# EAGLE design main (EAGLE 5.04)

## Sheet 1 of 2
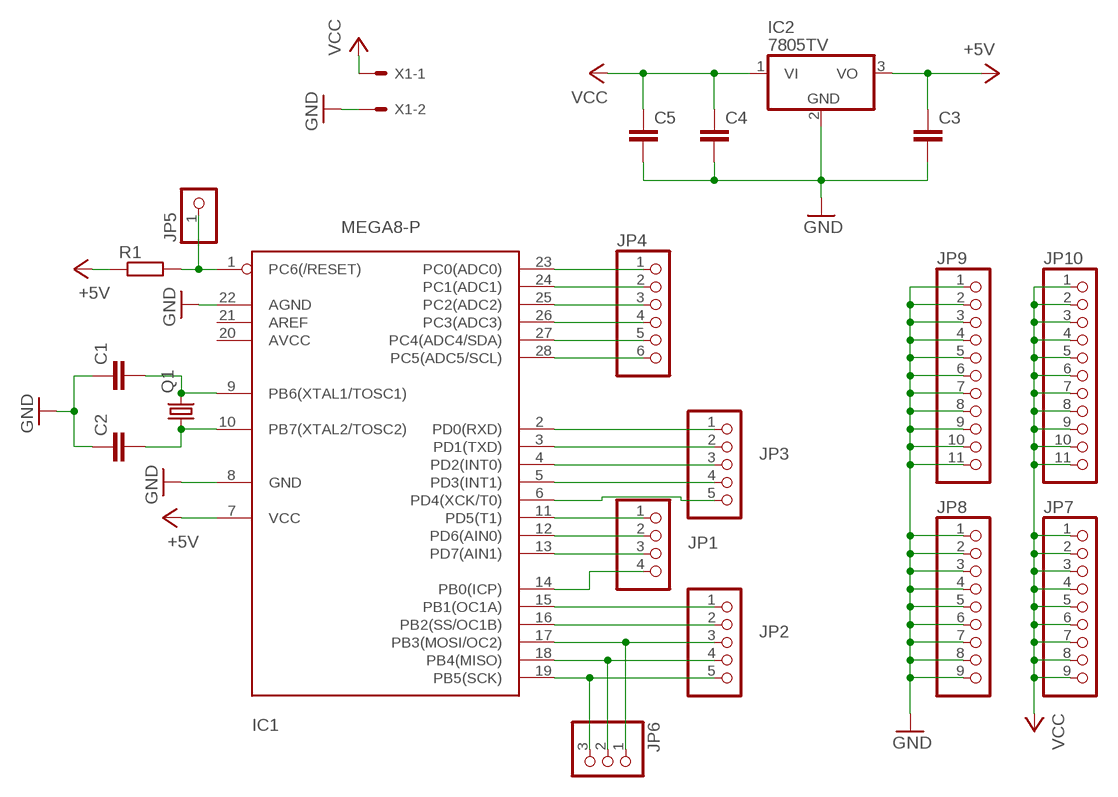
[diagram p0: schematic, sheet 1]

### Parts
C1  C-EUC0805  [C0805]
C2  C-EUC0805  [C0805]
C3  C-EUC1206  [C1206]
C4  C-EUC1206  [C1206]
C5  C-EUC1206  [C1206]
IC1  MEGA8-P  [DIL28-3]
IC2  7805TV  [TO220V]
JP1  PINHD-1X4  [1X04]
JP2  PINHD-1X5  [1X05]
JP3  PINHD-1X5  [1X05]
JP4  PINHD-1X6  [1X06]
JP5  PINHD-1X1  [1X01]
JP6  PINHD-1X3  [1X03]
JP7  PINHD-1X9  [1X09]
JP8  PINHD-1X9  [1X09]
JP9  PINHD-1X11  [1X11]
JP10  PINHD-1X11  [1X11]
Q1  CRYSTALHC49U70  [HC49U70]
R1  R-EU_R0805  [R0805]
X1  KK-156-2  [KK-156-2]

### Nets
+5V: C3.1 IC1.7(VCC) IC2.3(VO) R1.1
GND: C1.1 C2.1 C3.2 C4.2 C5.2 IC1.8(GND) IC1.22(AGND) IC2.2(GND) JP8.1 JP8.2 JP8.3 JP8.4 JP8.5 JP8.6 JP8.7 JP8.8 JP8.9 JP9.1 JP9.2 JP9.3 JP9.4 JP9.5 JP9.6 JP9.7 JP9.8 JP9.9 JP9.10 JP9.11 X1.2
N$1: IC1.13(PD7(AIN1)) JP1.3
N$2: IC1.12(PD6(AIN0)) JP1.2
N$3: IC1.11(PD5(T1)) JP1.1
N$4: IC1.14(PB0(ICP)) JP1.4
N$5: IC1.23(PC0(ADC0)) JP4.1
N$6: IC1.24(PC1(ADC1)) JP4.2
N$7: IC1.25(PC2(ADC2)) JP4.3
N$8: IC1.26(PC3(ADC3)) JP4.4
N$9: IC1.27(PC4(ADC4/SDA)) JP4.5
N$10: IC1.28(PC5(ADC5/SCL)) JP4.6
N$11: IC1.2(PD0(RXD)) JP3.1
N$12: IC1.3(PD1(TXD)) JP3.2
N$13: IC1.4(PD2(INT0)) JP3.3
N$14: IC1.5(PD3(INT1)) JP3.4
N$15: IC1.6(PD4(XCK/T0)) JP3.5
N$16: IC1.15(PB1(OC1A)) JP2.1
N$17: IC1.16(PB2(SS/OC1B)) JP2.2
N$18: IC1.17(PB3(MOSI/OC2)) JP2.3 JP6.1
N$19: IC1.18(PB4(MISO)) JP2.4 JP6.2
N$20: IC1.19(PB5(SCK)) JP2.5 JP6.3
N$21: C2.2 IC1.10(PB7(XTAL2/TOSC2)) Q1.1
N$22: C1.2 IC1.9(PB6(XTAL1/TOSC1)) Q1.2
N$25: IC1.1(PC6(/RESET)) JP5.1 R1.2
VCC: C4.1 C5.1 IC2.1(VI) JP7.1 JP7.2 JP7.3 JP7.4 JP7.5 JP7.6 JP7.7 JP7.8 JP7.9 JP10.1 JP10.2 JP10.3 JP10.4 JP10.5 JP10.6 JP10.7 JP10.8 JP10.9 JP10.10 JP10.11 X1.1
Unconnected: IC1.21(AREF)

## Sheet 2 of 2
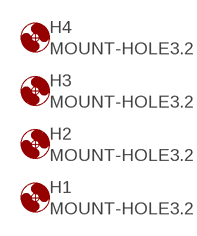
[diagram p1: schematic, sheet 2]

### Parts
H1  MOUNT-HOLE3.2  [3,2]
H2  MOUNT-HOLE3.2  [3,2]
H3  MOUNT-HOLE3.2  [3,2]
H4  MOUNT-HOLE3.2  [3,2]

## Power pins joined to a net without a drawn wire
AVCC: IC1.20(AVCC)

## Library data of the parts
C1-C5 = rcl:C-EU: CAPACITOR, European symbol
H1-H4 = holes:MOUNT-HOLE: MOUNTING HOLE with drill center marker
IC1 = atmel:MEGA8-P: MICROCONTROLLER 8 Kbytes FLASH, 1 kbytes SRAM, 512 bytes EEPROM, USART, 4-channel 10 bit ADC, 2-channel 8 bit ADC Pin compatible with Atmega48, ATMega88, ATMega168 Source: avr.lbr
IC2 = linear:78*: Positive VOLTAGE REGULATOR Source: http://cache.national.com/ds/LM/LM78L05.pdf http://www.fairchildsemi.com/ds/LM/LM7805.pdf
JP1 = pinhead:PINHD-1X4: PIN HEADER
JP2 JP3 = pinhead:PINHD-1X5: PIN HEADER
JP4 = pinhead:PINHD-1X6: PIN HEADER
JP5 = pinhead:PINHD-1X1: PIN HEADER
JP6 = pinhead:PINHD-1X3: PIN HEADER
JP7 JP8 = pinhead:PINHD-1X9: PIN HEADER
JP9 JP10 = pinhead:PINHD-1X11: PIN HEADER
Q1 = crystal:CRYSTAL: CRYSTAL
R1 = rcl:R-EU_: RESISTOR, European symbol
X1 = con-molex:KK-156-2: KK 156 HEADER Source: http://www.molex.com/pdm_docs/sd/026604100_sd.pdf

## Board
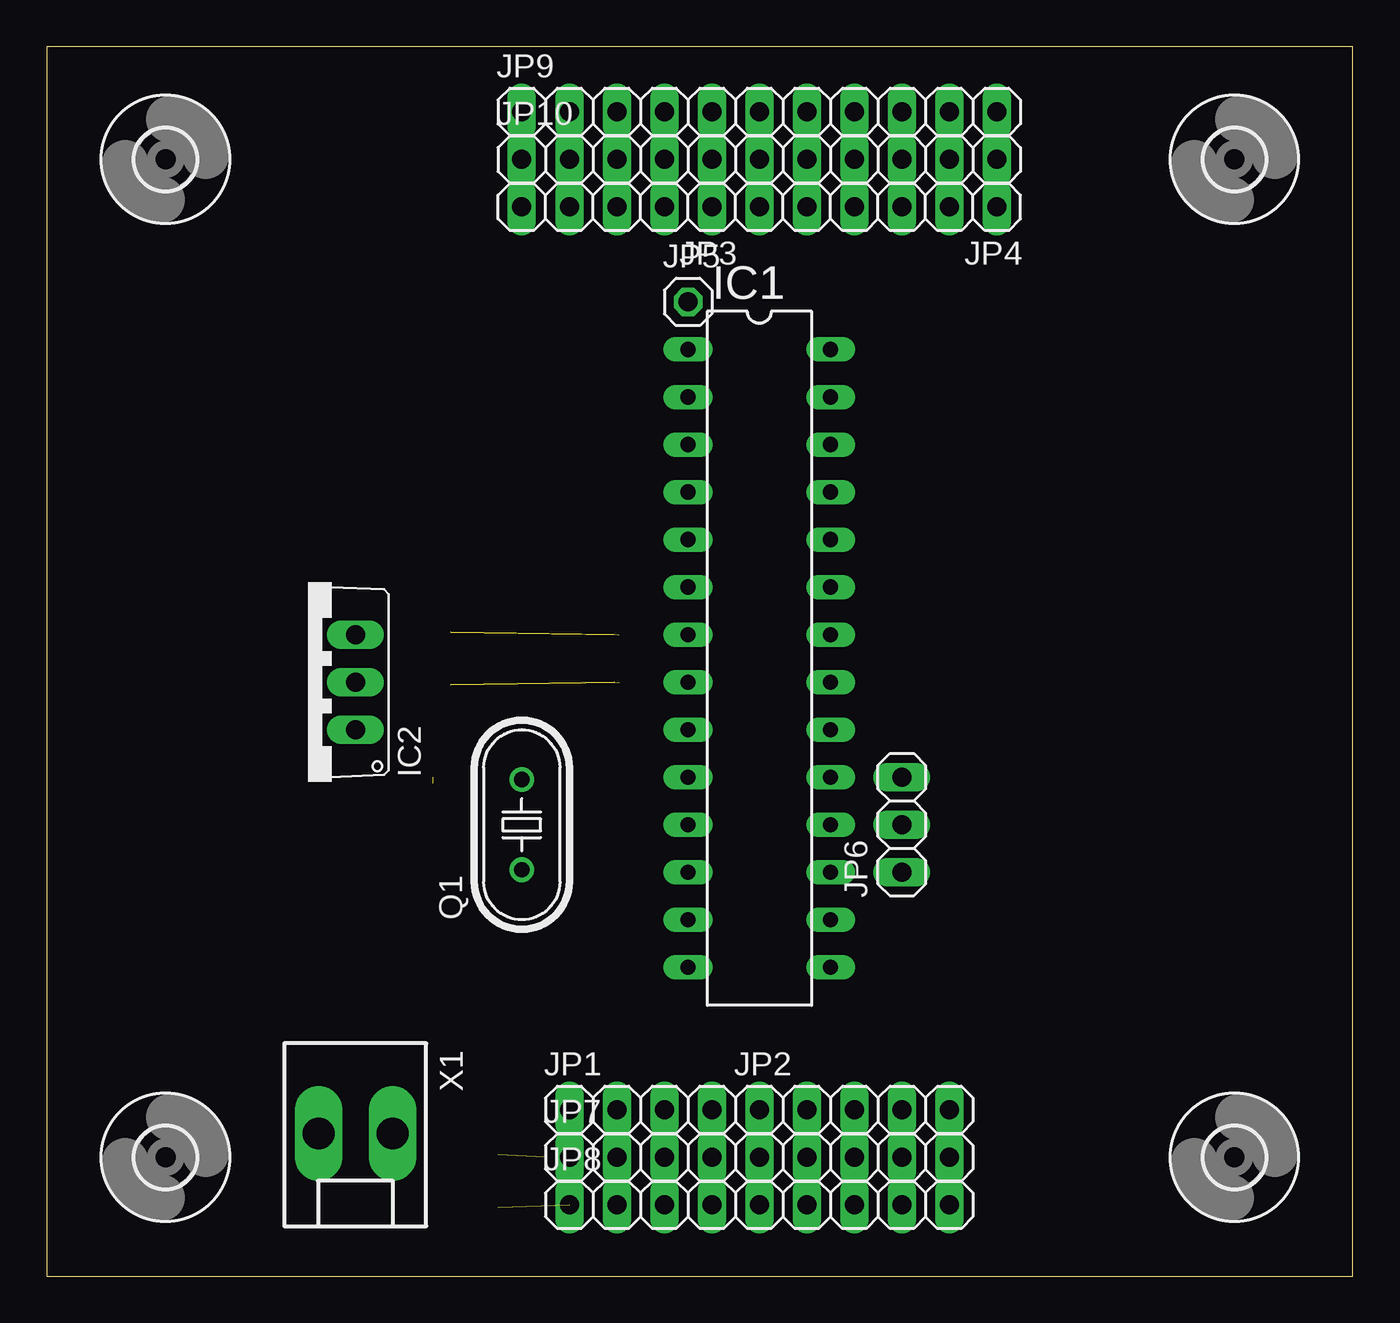
[diagram p2: board, top side]
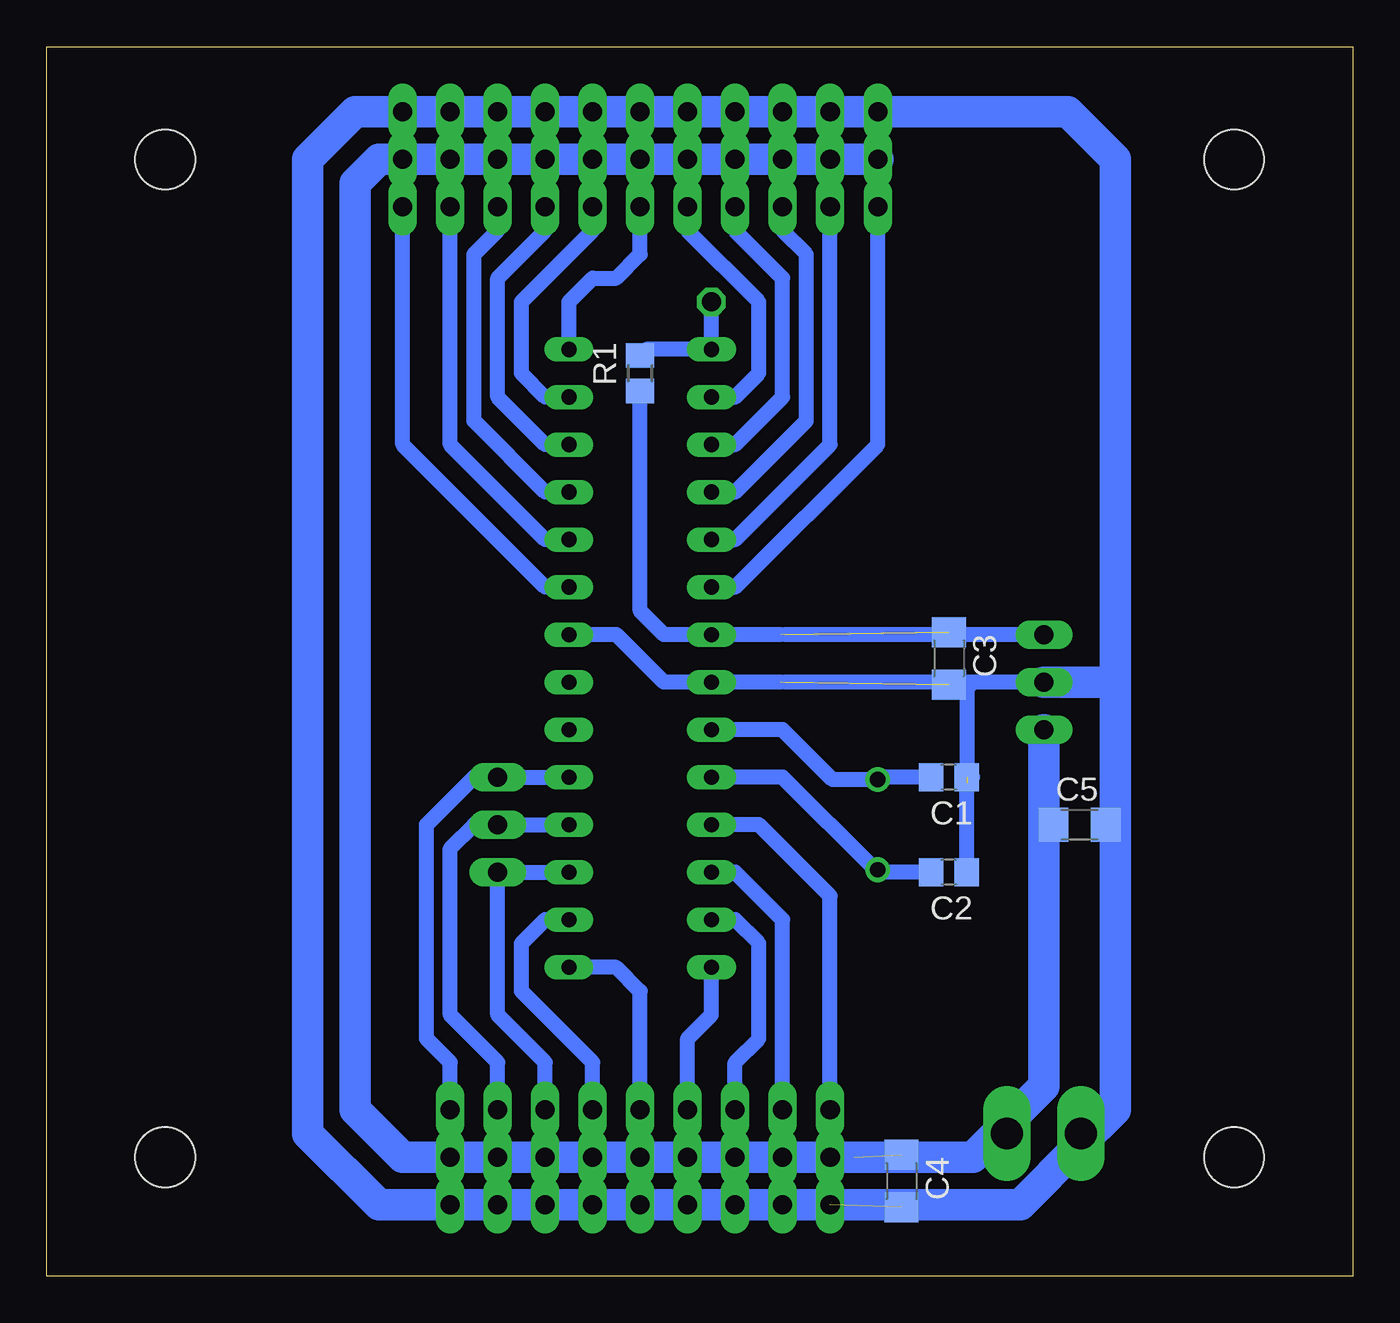
[diagram p3: board, bottom side, seen from below]

Size 69.83 x 65.71 mm. Coordinates in mm from the lower left corner, seen from the top.
Outline: 0,0 69.83,0 69.83,65.71 0,65.71 0,0
Copper layers (1*16): Top 0.035mm / dielectric 1.5mm / Bottom 0.035mm
Design rules "default *": minimum track width 10mil, minimum drill 24mil, track to track 8mil, track to pad 8mil, pad to pad 8mil, via to via 8mil, smd to smd 8mil, copper to edge 40mil, drill to drill 8mil, minimum pad ring 10mil, minimum via ring 8mil, stop-mask expansion 4mil, vias tented up to drill 0mil, thermal gap 10mil

### Footprints (pad centres in the part's own frame; a part is rotated, then mirrored left to right if it is on the bottom)
C0805 = smd 1.3 x 1.5: 1 -0.95,0; 2 0.95,0
C1206 = smd 1.6 x 1.8: 1 -1.4,0; 2 1.4,0
3,2 = hole 3.2: 0,0
DIL28-3 = drill 0.813 long: 1 -16.51,-3.81; 2 -13.97,-3.81; 3 -11.43,-3.81; 4 -8.89,-3.81; 5 -6.35,-3.81; 6 -3.81,-3.81; 7 -1.27,-3.81; 8 1.27,-3.81; 9 3.81,-3.81; 10 6.35,-3.81; 11 8.89,-3.81; 12 11.43,-3.81; 13 13.97,-3.81; 14 16.51,-3.81; 15 16.51,3.81; 16 13.97,3.81; 17 11.43,3.81; 18 8.89,3.81; 19 6.35,3.81; 20 3.81,3.81; 21 1.27,3.81; 22 -1.27,3.81; 23 -3.81,3.81; 24 -6.35,3.81; 25 -8.89,3.81; 26 -11.43,3.81; 27 -13.97,3.81; 28 -16.51,3.81
TO220V = drill 1.016 long: 1 -2.54,-2.54; 2 0,-2.54; 3 2.54,-2.54
1X04 = drill 1.016 long: 1 -3.81,0; 2 -1.27,0; 3 1.27,0; 4 3.81,0
1X05 = drill 1.016 long: 1 -5.08,0; 2 -2.54,0; 3 0,0; 4 2.54,0; 5 5.08,0
1X06 = drill 1.016 long: 1 -6.35,0; 2 -3.81,0; 3 -1.27,0; 4 1.27,0; 5 3.81,0; 6 6.35,0
1X01 = drill 1.016 octagon: 1 0,0
1X03 = drill 1.016 long: 1 -2.54,0; 2 0,0; 3 2.54,0
1X09 = drill 1.016 long: 1 -10.16,0; 2 -7.62,0; 3 -5.08,0; 4 -2.54,0; 5 0,0; 6 2.54,0; 7 5.08,0; 8 7.62,0; 9 10.16,0
1X11 = drill 1.016 long: 1 -12.7,0; 2 -10.16,0; 3 -7.62,0; 4 -5.08,0; 5 -2.54,0; 6 0,0; 7 2.54,0; 8 5.08,0; 9 7.62,0; 10 10.16,0; 11 12.7,0
HC49U70 = drill 0.813 round: 1 -2.413,0; 2 2.413,0
R0805 = smd 1.3 x 1.5: 1 -0.95,0; 2 0.95,0
KK-156-2 = drill 1.7 pad 2.184 long: 1 -1.98,0; 2 1.98,0

### Placement (x,y rotation side)
C1  21.59,26.67 180 bottom
C2  21.59,21.59 180 bottom
C3  21.59,33.02 270 bottom
C4  24.13,5.08 270 bottom
C5  14.61,24.13 0 bottom
H1  6.35,6.35 0 top
H2  63.5,6.35 0 top
H3  6.35,59.69 0 top
H4  63.5,59.69 0 top
IC1  38.1,33.02 270 top
IC2  13.97,31.75 90 top
JP1  31.75,8.89 0 top
JP2  43.18,8.89 0 top
JP3  30.48,57.15 180 top
JP4  44.45,57.15 180 top
JP5  34.29,52.07 0 top
JP6  45.72,24.13 90 top
JP7  38.1,6.35 0 top
JP8  38.1,3.81 0 top
JP9  38.1,62.23 0 top
JP10  38.1,59.69 0 top
Q1  25.4,24.13 90 top
R1  38.1,48.26 90 bottom
X1  16.51,7.62 180 top

### Tracks (layer width: path | path; a pad name or v marks a point on that pad's centre or on a via)
+5V  (2 unrouted)
  Bottom 0.813: R1.1 38.1,35.56 36.83,34.29 IC1.7 30.61,34.29 | IC2.3 30.35,34.29
GND  (4 unrouted)
  Bottom 0.813: IC1.22 39.37,34.29 36.83,31.75 IC1.8 30.61,31.75 | IC2.2 20.32,31.75 | 20.32,31.75 30.35,31.75 | C2.1 20.64,26.35 20.32,26.67 | C1.1 20.64,31.43 20.32,31.75 | 12.7,24.13 C5.2
  Bottom 1.676: JP9.2 JP9.1 15.24,62.23 12.7,59.69 12.7,31.75 | JP9.2 JP9.3 | JP9.3 JP9.4 | JP9.5 JP9.6 JP9.7 JP9.8 JP9.9 JP9.10 JP9.11 53.34,62.23 55.88,59.69 55.88,7.62 52.07,3.81 JP8.9 JP8.8 JP8.7 JP8.6 JP8.5 JP8.4 JP8.3 JP8.2 JP8.1 17.78,3.81 14.61,6.99 | JP9.2 JP9.3 | JP9.4 JP9.5 | JP9.4 JP9.5 | 14.61,6.99 12.7,8.89 12.7,24.13 12.7,31.75 | 12.7,31.75 IC2.2 | X1.2 14.53,7.06 14.61,6.99
N$1
  Bottom 0.813: JP1.3 33.02,11.43 31.75,12.7 31.75,17.78 33.02,19.05 IC1.13
N$2
  Bottom 0.813: JP1.2 30.48,19.05 33.02,21.59 IC1.12
N$3
  Bottom 0.813: JP1.1 27.94,20.32 31.75,24.13 IC1.11
N$4
  Bottom 0.813: JP1.4 35.56,12.7 34.29,13.97 IC1.14
N$5
  Bottom 0.813: JP4.1 50.8,44.45 43.18,36.83 IC1.23
N$6
  Bottom 0.813: JP4.2 48.26,44.45 43.18,39.37 IC1.24
N$7
  Bottom 0.813: JP4.3 45.72,55.88 46.99,54.61 46.99,45.72 43.18,41.91 IC1.25
N$8
  Bottom 0.813: JP4.4 43.18,55.88 45.72,53.34 45.72,46.99 43.18,44.45 IC1.26
N$9
  Bottom 0.813: JP4.5 40.64,55.88 44.45,52.07 44.45,48.26 43.18,46.99 IC1.27
N$10
  Bottom 0.813: JP4.6 38.1,54.61 39.37,53.34 40.64,53.34 41.91,52.07 IC1.28
N$11
  Bottom 0.813: JP3.1 35.56,55.88 31.75,52.07 31.75,48.26 33.02,46.99 IC1.2
N$12
  Bottom 0.813: JP3.2 33.02,55.88 30.48,53.34 30.48,46.99 33.02,44.45 IC1.3
N$13
  Bottom 0.813: JP3.3 30.48,55.88 29.21,54.61 29.21,45.72 33.02,41.91 IC1.4
N$14
  Bottom 0.813: JP3.4 27.94,44.45 33.02,39.37 IC1.5
N$15
  Bottom 0.813: JP3.5 25.4,44.45 33.02,36.83 IC1.6
N$16
  Bottom 0.813: IC1.15 39.37,16.51 38.1,15.24 JP2.1
N$17
  Bottom 0.813: IC1.16 43.18,19.05 44.45,17.78 44.45,15.24 40.64,11.43 JP2.2
N$18
  Bottom 0.813: JP2.3 43.18,11.43 45.72,13.97 JP6.1 IC1.17
N$19
  Bottom 0.813: JP2.4 45.72,11.43 48.26,13.97 48.26,22.86 46.99,24.13 JP6.2 IC1.18
N$20
  Bottom 0.813: JP2.5 48.26,11.43 49.53,12.7 49.53,24.13 46.99,26.67 JP6.3 IC1.19
N$21
  Bottom 0.813: IC1.10 30.48,26.67 25.53,21.72 Q1.1 25.27,21.59 C2.2
N$22
  Bottom 0.813: IC1.9 30.48,29.21 27.81,26.54 Q1.2 25.27,26.67 C1.2
N$25
  Bottom 0.813: JP5.1 IC1.1 37.78,49.53 R1.2
VCC  (1 unrouted)
  Bottom 0.813: C5.1 16.38,29.08 IC2.1
  Bottom 1.676: JP7.1 JP7.2 JP7.3 JP7.4 JP7.5 JP7.6 JP7.7 JP7.8 JP7.9 50.8,6.35 53.34,8.89 53.34,58.42 52.07,59.69 JP10.11 JP10.10 JP10.9 JP10.8 JP10.7 JP10.6 JP10.5 JP10.4 JP10.3 JP10.2 JP10.1 | JP7.1 26.67,6.35 | JP7.1 20.32,6.35 19.05,7.62 | 19.05,7.62 16.51,10.16 IC2.1 | X1.1 19.05,7.62